# Altium schematic sheet ExternalConnection.SchDoc: {Наименование}
size 420 x 297 mm; ApprovedBy: {Утвердил}; CheckedBy: {Проверил}; DrawnBy: {Разработал}; Engineer: {Инженер}; DocumentNumber: {Обозначение}; SheetNumber: 1; SheetTotal: 5; Scale: {Масш.}; Title1str: {Наименование}; PageSetup: Record=PageOptionsZCenterHorizontal=FalseZCenterVertical=FalseZPrintScale=0.95ZXCorrection=0.00ZYCorrection=0.00ZPrintKind=1ZBorderSize=5000000ZLeftOffset=0ZBottomOffset=0ZOrientation=1ZPaperLength=1000ZPaperWidth=1000ZScale=100ZPaperSource=15ZPrintQuality=600ZMediaType=1ZDitherType=10ZPaperKind=A4ZPrintScaleMode=1; Title2str: {Наименование}; ProcessInspection: {Т.контр.}; Mass: {Масса}; NormInspection: {Н.контр.}; EngineerName: {Инженер}; Letter1Column: {}; Letter2Column: {}; Letter3Column: {}; DocumentType: {Документ}; DocumentType1str: {Документ}; DocumentType2str: {Документ}; FirstReferrence: {Перв. применение}; InvNumber: {Инв№}; InvDATA: {InvDATA}; Title1str_small: {Наименование}; Title2str_small: {Наименование}; Rule: PcbType=ProtelPcb
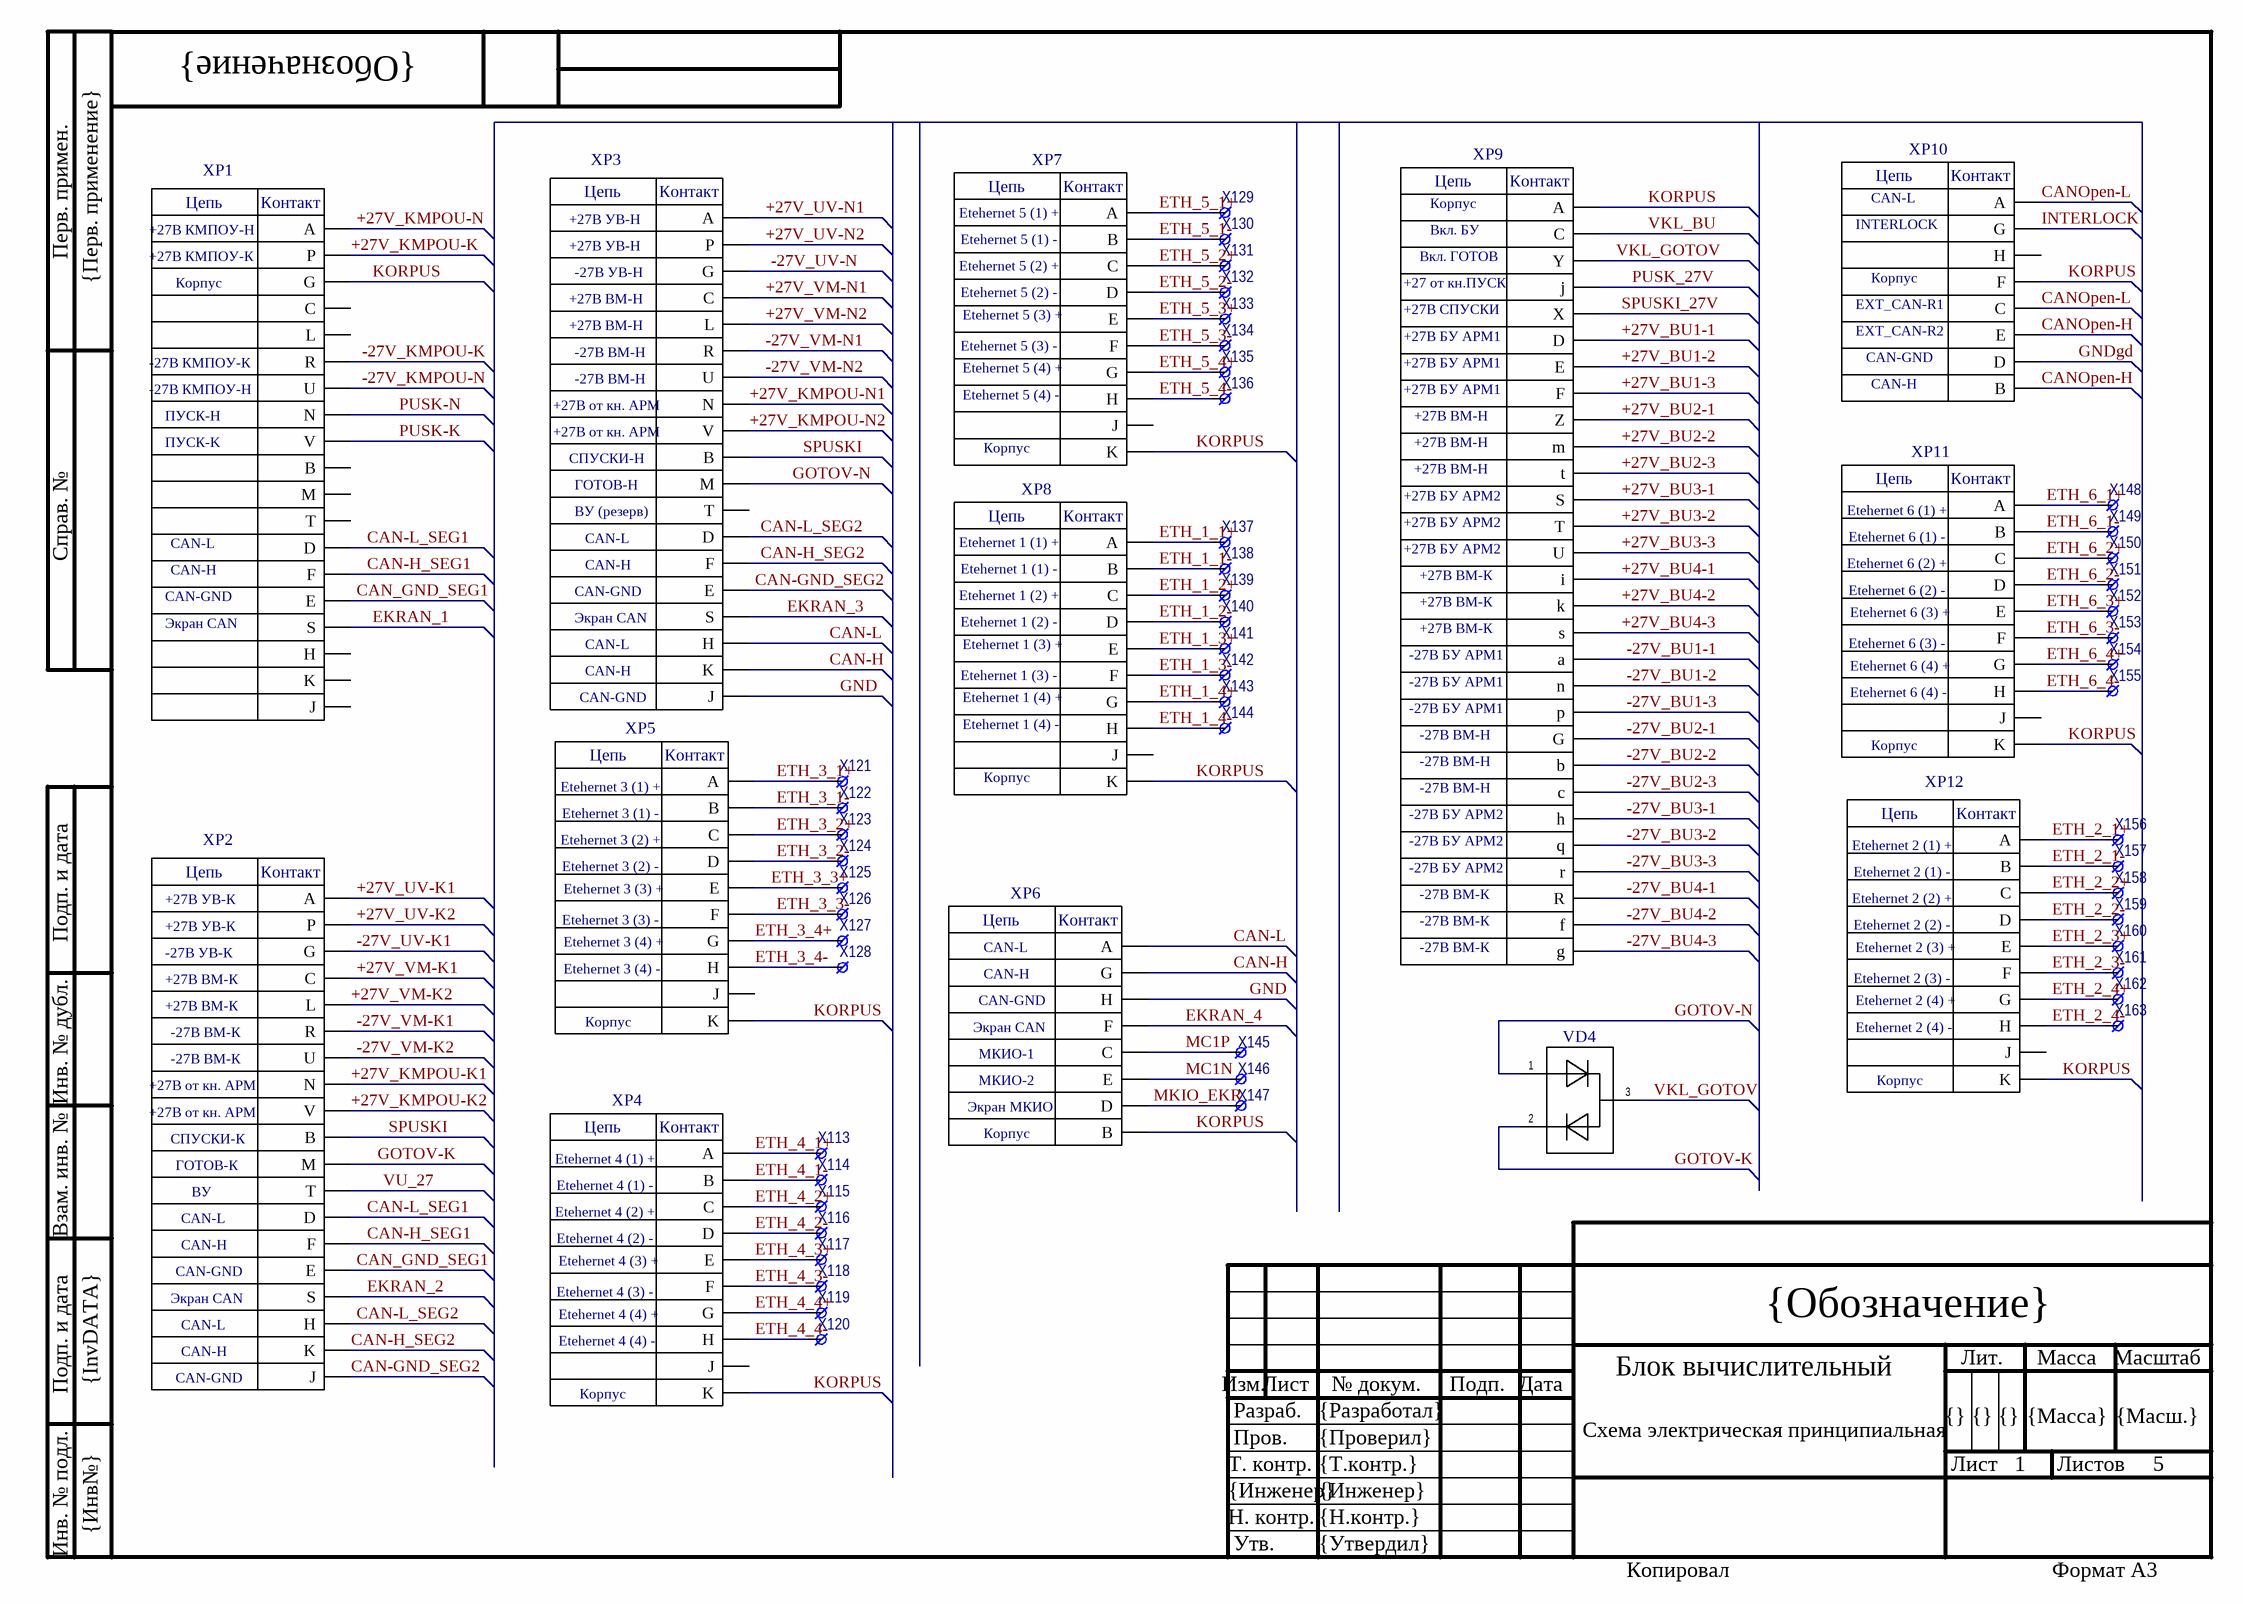
[diagram p0: ExternalConnection.SchDoc]

## Parts
VD4  2Д707АС9  [KT-46]  (value not drawn)
X113  CONT  [ПЛАН_ПЛОЩ]  (value not drawn)
X114  CONT  [ПЛАН_ПЛОЩ]  (value not drawn)
X115  CONT  [ПЛАН_ПЛОЩ]  (value not drawn)
X116  CONT  [ПЛАН_ПЛОЩ]  (value not drawn)
X117  CONT  [ПЛАН_ПЛОЩ]  (value not drawn)
X118  CONT  [ПЛАН_ПЛОЩ]  (value not drawn)
X119  CONT  [ПЛАН_ПЛОЩ]  (value not drawn)
X120  CONT  [ПЛАН_ПЛОЩ]  (value not drawn)
X121  CONT  [ПЛАН_ПЛОЩ]  (value not drawn)
X122  CONT  [ПЛАН_ПЛОЩ]  (value not drawn)
X123  CONT  [ПЛАН_ПЛОЩ]  (value not drawn)
X124  CONT  [ПЛАН_ПЛОЩ]  (value not drawn)
X125  CONT  [ПЛАН_ПЛОЩ]  (value not drawn)
X126  CONT  [ПЛАН_ПЛОЩ]  (value not drawn)
X127  CONT  [ПЛАН_ПЛОЩ]  (value not drawn)
X128  CONT  [ПЛАН_ПЛОЩ]  (value not drawn)
X129  CONT  [ПЛАН_ПЛОЩ]  (value not drawn)
X130  CONT  [ПЛАН_ПЛОЩ]  (value not drawn)
X131  CONT  [ПЛАН_ПЛОЩ]  (value not drawn)
X132  CONT  [ПЛАН_ПЛОЩ]  (value not drawn)
X133  CONT  [ПЛАН_ПЛОЩ]  (value not drawn)
X134  CONT  [ПЛАН_ПЛОЩ]  (value not drawn)
X135  CONT  [ПЛАН_ПЛОЩ]  (value not drawn)
X136  CONT  [ПЛАН_ПЛОЩ]  (value not drawn)
X137  CONT  [ПЛАН_ПЛОЩ]  (value not drawn)
X138  CONT  [ПЛАН_ПЛОЩ]  (value not drawn)
X139  CONT  [ПЛАН_ПЛОЩ]  (value not drawn)
X140  CONT  [ПЛАН_ПЛОЩ]  (value not drawn)
X141  CONT  [ПЛАН_ПЛОЩ]  (value not drawn)
X142  CONT  [ПЛАН_ПЛОЩ]  (value not drawn)
X143  CONT  [ПЛАН_ПЛОЩ]  (value not drawn)
X144  CONT  [ПЛАН_ПЛОЩ]  (value not drawn)
X145  CONT  [ПЛАН_ПЛОЩ]  (value not drawn)
X146  CONT  [ПЛАН_ПЛОЩ]  (value not drawn)
X147  CONT  [ПЛАН_ПЛОЩ]  (value not drawn)
X148  CONT  [ПЛАН_ПЛОЩ]  (value not drawn)
X149  CONT  [ПЛАН_ПЛОЩ]  (value not drawn)
X150  CONT  [ПЛАН_ПЛОЩ]  (value not drawn)
X151  CONT  [ПЛАН_ПЛОЩ]  (value not drawn)
X152  CONT  [ПЛАН_ПЛОЩ]  (value not drawn)
X153  CONT  [ПЛАН_ПЛОЩ]  (value not drawn)
X154  CONT  [ПЛАН_ПЛОЩ]  (value not drawn)
X155  CONT  [ПЛАН_ПЛОЩ]  (value not drawn)
X156  CONT  [ПЛАН_ПЛОЩ]  (value not drawn)
X157  CONT  [ПЛАН_ПЛОЩ]  (value not drawn)
X158  CONT  [ПЛАН_ПЛОЩ]  (value not drawn)
X159  CONT  [ПЛАН_ПЛОЩ]  (value not drawn)
X160  CONT  [ПЛАН_ПЛОЩ]  (value not drawn)
X161  CONT  [ПЛАН_ПЛОЩ]  (value not drawn)
X162  CONT  [ПЛАН_ПЛОЩ]  (value not drawn)
X163  CONT  [ПЛАН_ПЛОЩ]  (value not drawn)
XP1  СНЦ144-19  [XP_СНЦ144-19/15-вилка]  (value not drawn)
XP2  СНЦ144-19  [XP_СНЦ144-19/15-вилка]  (value not drawn)
XP3  СНЦ144-19  [XP_СНЦ144-19/15-вилка]  (value not drawn)
XP4  СНЦ144-10  [XP_СНЦ144-10_13-вилка]  (value not drawn)
XP5  СНЦ144-10  [XP_СНЦ144-10_13-вилка]  (value not drawn)
XP6  СНЦ144-8  [XP_СНЦ144-8_13-Вилка]  (value not drawn)
XP7  СНЦ144-10  [XP_СНЦ144-10_13-вилка]  (value not drawn)
XP8  СНЦ144-10  [XP_СНЦ144-10_13-вилка]  (value not drawn)
XP9  СНЦ144-41  [XP_СНЦ144-41_21-вилка]  (value not drawn)
XP10  СНЦ144-8  [XP_СНЦ144-8_13-Вилка]  (value not drawn)
XP11  СНЦ144-10  [XP_СНЦ144-10_13-вилка]  (value not drawn)
XP12  СНЦ144-10  [XP_СНЦ144-10_13-вилка]  (value not drawn)

## Nets
+27V_BU1-1: XP9.D
+27V_BU1-2: XP9.E
+27V_BU1-3: XP9.F
+27V_BU2-1: XP9.Z
+27V_BU2-2: XP9.mm(m)
+27V_BU2-3: XP9.tt(t)
+27V_BU3-1: XP9.S
+27V_BU3-2: XP9.T
+27V_BU3-3: XP9.U
+27V_BU4-1: XP9.ii(i)
+27V_BU4-2: XP9.kk(k)
+27V_BU4-3: XP9.ss(s)
+27V_KMPOU-K: XP1.P
+27V_KMPOU-K1: XP2.N
+27V_KMPOU-K2: XP2.V
+27V_KMPOU-N: XP1.A
+27V_KMPOU-N1: XP3.N
+27V_KMPOU-N2: XP3.V
+27V_UV-K1: XP2.A
+27V_UV-K2: XP2.P
+27V_UV-N1: XP3.A
+27V_UV-N2: XP3.P
+27V_VM-K1: XP2.C
+27V_VM-K2: XP2.L
+27V_VM-N1: XP3.C
+27V_VM-N2: XP3.L
-27V_BU1-1: XP9.aa(a)
-27V_BU1-2: XP9.nn(n)
-27V_BU1-3: XP9.pp(p)
-27V_BU2-1: XP9.G
-27V_BU2-2: XP9.bb(b)
-27V_BU2-3: XP9.cc(c)
-27V_BU3-1: XP9.hh(h)
-27V_BU3-2: XP9.qq(q)
-27V_BU3-3: XP9.rr(r)
-27V_BU4-1: XP9.R
-27V_BU4-2: XP9.ff(f)
-27V_BU4-3: XP9.gg(g)
-27V_KMPOU-K: XP1.R
-27V_KMPOU-N: XP1.U
-27V_UV-K1: XP2.G
-27V_UV-N: XP3.G
-27V_VM-K1: XP2.R
-27V_VM-K2: XP2.U
-27V_VM-N1: XP3.R
-27V_VM-N2: XP3.U
CAN-GND_SEG2: XP2.J XP3.E
CAN-H: XP3.K XP6.G
CAN-H_SEG1: XP1.F XP2.F
CAN-H_SEG2: XP2.K XP3.F
CAN-L: XP3.H XP6.A
CAN-L_SEG1: XP1.D XP2.D
CAN-L_SEG2: XP2.H XP3.D
CAN_GND_SEG1: XP1.E XP2.E
CANOpen-H: XP10.B XP10.E
CANOpen-L: XP10.A XP10.C
EKRAN_1: XP1.S
EKRAN_2: XP2.S
EKRAN_3: XP3.S
EKRAN_4: XP6.F
ETH_1_1+: X137.1 XP8.A
ETH_1_1-: X138.1 XP8.B
ETH_1_2+: X139.1 XP8.C
ETH_1_2-: X140.1 XP8.D
ETH_1_3+: X141.1 XP8.E
ETH_1_3-: X142.1 XP8.F
ETH_1_4+: X143.1 XP8.G
ETH_1_4-: X144.1 XP8.H
ETH_2_1+: X156.1 XP12.A
ETH_2_1-: X157.1 XP12.B
ETH_2_2+: X158.1 XP12.C
ETH_2_2-: X159.1 XP12.D
ETH_2_3+: X160.1 XP12.E
ETH_2_3-: X161.1 XP12.F
ETH_2_4+: X162.1 XP12.G
ETH_2_4-: X163.1 XP12.H
ETH_3_1+: X121.1 XP5.A
ETH_3_1-: X122.1 XP5.B
ETH_3_2+: X123.1 XP5.C
ETH_3_2-: X124.1 XP5.D
ETH_3_3+: X125.1 XP5.E
ETH_3_3-: X126.1 XP5.F
ETH_3_4+: X127.1 XP5.G
ETH_3_4-: X128.1 XP5.H
ETH_4_1+: X113.1 XP4.A
ETH_4_1-: X114.1 XP4.B
ETH_4_2+: X115.1 XP4.C
ETH_4_2-: X116.1 XP4.D
ETH_4_3+: X117.1 XP4.E
ETH_4_3-: X118.1 XP4.F
ETH_4_4+: X119.1 XP4.G
ETH_4_4-: X120.1 XP4.H
ETH_5_1+: X129.1 XP7.A
ETH_5_1-: X130.1 XP7.B
ETH_5_2+: X131.1 XP7.C
ETH_5_2-: X132.1 XP7.D
ETH_5_3+: X133.1 XP7.E
ETH_5_3-: X134.1 XP7.F
ETH_5_4+: X135.1 XP7.G
ETH_5_4-: X136.1 XP7.H
ETH_6_1+: X148.1 XP11.A
ETH_6_1-: X149.1 XP11.B
ETH_6_2+: X150.1 XP11.C
ETH_6_2-: X151.1 XP11.D
ETH_6_3+: X152.1 XP11.E
ETH_6_3-: X153.1 XP11.F
ETH_6_4+: X154.1 XP11.G
ETH_6_4-: X155.1 XP11.H
GND: XP3.J XP6.H
GNDgd: XP10.D
GOTOV-K: VD4.2 XP2.M
GOTOV-N: VD4.1 XP3.M
INTERLOCK: XP10.G
KORPUS: XP1.G XP4.K XP5.K XP6.B XP7.K XP8.K XP9.A XP10.F XP11.K XP12.K
MC1N: X146.1 XP6.E
MC1P: X145.1 XP6.C
MKIO_EKR: X147.1 XP6.D
PUSK-K: XP1.V
PUSK-N: XP1.N
PUSK_27V: XP9.jj(j)
SPUSKI: XP2.B XP3.B
SPUSKI_27V: XP9.X
VKL_BU: XP9.C
VKL_GOTOV: VD4.3 XP9.Y
VU_27: XP2.T

Not connected (* = marked no-connect by the designer): XP1 B C H J K L M T; XP3 T; XP4 J; XP5 J; XP7 J; XP8 J; XP10 H; XP11 J; XP12 J

## Notes on the sheet
- Перв. примен.
- +27В КМПОУ-Н
- +27В КМПОУ-К
- +27В УВ-Н
- Etehernet 5 (1) +
- Etehernet 5 (1) -
- Etehernet 5 (2) +
- Вкл. ГОТОВ
- Корпус
- Вкл. БУ
- INTERLOCK
- CAN-L
- +27В ВМ-Н
- -27В УВ-Н
- (near XP7) Etehernet 5 (3) +
- Etehernet 5 (2) -
- +27 от кн.ПУСК
- +27В СПУСКИ
- EXT_CAN-R1
- -27В КМПОУ-Н
- -27В КМПОУ-К
- -27В ВМ-Н
- (near XP7) Etehernet 5 (4) +
- Etehernet 5 (3) -
- +27В БУ АРМ1
- EXT_CAN-R2
- CAN-GND
- CAN-H
- ПУСК-Н
- ПУСК-K
- +27В от кн. АРМ
- СПУСКИ-Н
- (near XP7) Etehernet 5 (4) -
- Справ. №
- ГОТОВ-Н
- ВУ (резерв)
- +27В БУ АРМ2
- Etehernet 6 (1) +
- Etehernet 6 (1) -
- Etehernet 1 (1) +
- Etehernet 1 (1) -
- Etehernet 1 (2) +
- +27В ВМ-К
- Etehernet 6 (2) +
- Etehernet 6 (2) -
- Экран CAN
- (near XP8) Etehernet 1 (3) +
- Etehernet 1 (2) -
- -27В БУ АРМ1
- (near XP11) Etehernet 6 (3) +
- Etehernet 6 (3) -
- (near XP8) Etehernet 1 (4) +
- (near XP8) Etehernet 1 (4) -
- Etehernet 1 (3) -
- (near XP11) Etehernet 6 (4) +
- (near XP11) Etehernet 6 (4) -
- Etehernet 3 (1) +
- Etehernet 3 (1) -
- Etehernet 3 (2) +
- Etehernet 3 (2) -
- -27В БУ АРМ2
- Etehernet 2 (1) +
- Etehernet 2 (1) -
- Подп. и дата
- +27В УВ-К
- (near XP5) Etehernet 3 (3) +
- Etehernet 3 (3) -
- -27В ВМ-К
- Etehernet 2 (2) +
- Etehernet 2 (2) -
- -27В УВ-К
- (near XP5) Etehernet 3 (4) +
- (near XP5) Etehernet 3 (4) -
- (near XP12) Etehernet 2 (3) +
- (near XP12) Etehernet 2 (4) +
- Etehernet 2 (3) -
- Инв. № дубл.
- МКИО-1
- (near XP12) Etehernet 2 (4) -
- Экран МКИО
- МКИО-2
- Взам. инв. №
- СПУСКИ-К
- ГОТОВ-К
- ВУ
- Etehernet 4 (1) +
- Etehernet 4 (1) -
- Etehernet 4 (2) +
- (near XP4) Etehernet 4 (3) +
- Etehernet 4 (2) -
- (near XP4) Etehernet 4 (4) +
- Etehernet 4 (3) -
- (near XP4) Etehernet 4 (4) -
- Изм.
- Лист
- № докум.
- Подп.
- Дата
- Блок вычислительный
- Лит.
- Масса
- Масштаб
- Т. контр.
- Пров.
- Разраб.
- Схема электрическая принципиальная
- Листов
- Инв. № подл.
- Н. контр.
- Утв.
- Копировал
- Формат А3
- (in symbol СНЦ144-8) Цепь; Контакт
- (in symbol СНЦ144-10) Цепь; Контакт
- (in symbol СНЦ144-19) Цепь; Контакт
- (in symbol СНЦ144-41) Цепь; Контакт

## Library data of the parts
VD4 = 2Д707АС9: 2Д707АС9 диод импульсный; TU: аА0.339.583ТУ; TUHolder: ООО "НПК ДАЛЕКС"; TypePrefix: VD; Value: *; PartNumber: 2Д707АС9
X113-X163 = CONT: CONT1_SMD; PartNumber: контактное поле; Value: *
XP1-XP3 = СНЦ144-19: ВИЛКА СНЦ144-19 СОСТАВНАЯ; PartNumber: СНЦ144-19/15ВП21-NWПС; Value: Вилка СНЦ144-19/15ВП21-NWПС; TypePrefix: Изделия соеденительные; TU: ЦСНК.430421.008ТУ; TUHolder: ОАО 'Уральский завод электрических соединителей 'ИСЕТЬ', Россия, г. Каменск-Уральский; PackegeType: *
XP4 XP5 XP7 XP8 XP11 XP12 = СНЦ144-10: ВИЛКА СНЦ144-10 СОСТАВНАЯ; PartNumber: СНЦ144-10/13ВП21-NWПС; Value: Вилка СНЦ144-10/13ВП21-NWПС; TU: ЦСНК.430421.008ТУ; TUHolder: ОАО 'Уральский завод электрических соединителей 'ИСЕТЬ', Россия, г. Каменск-Уральский; TypePrefix: Изделия соеденительные; PackegeType: *
XP6 XP10 = СНЦ144-8: ВИЛКА СНЦ144-8 СОСТАВНАЯ; PartNumber: СНЦ144-8/13ВП21-NWПС; Value: Вилка СНЦ144-8/13ВП21-NWПС; TU: ЦСНК.430421.008ТУ; TUHolder: ОАО 'Уральский завод электрических соединителей 'ИСЕТЬ', Россия, г. Каменск-Уральский; TypePrefix: Изделия соеденительные; PackegeType: *
XP9 = СНЦ144-41: ВИЛКА СНЦ144-41 СОСТАВНАЯ; PartNumber: СНЦ144-41/21ВП21-NWПС; Value: Вилка СНЦ144-41/21ВП21-NWПС; TU: ЦСНК.430421.008ТУ; TUHolder: ОАО 'Уральский завод электрических соединителей 'ИСЕТЬ', Россия, г. Каменск-Уральский; TypePrefix: Изделия соеденительные; PackegeType: *